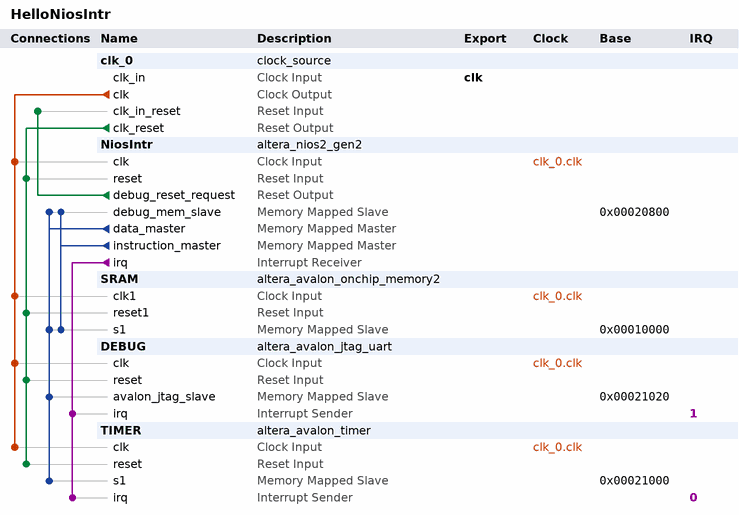
[diagram p0: system contents]
# Platform Designer (Qsys) system HelloNiosIntr, Cyclone V 5CSXFC6D6F31C6
# Parameters at their usual value, and those the tool derives, are not listed.
package require -exact qsys 21.1
create_system HelloNiosIntr
set_project_property DEVICE_FAMILY {Cyclone V}
set_project_property DEVICE 5CSXFC6D6F31C6

add_instance clk_0 clock_source 21.1
set_instance_parameter_value clk_0 clockFrequency 50000000

add_instance NiosIntr altera_nios2_gen2 21.1
set_instance_parameter_value NiosIntr dcache_size 2048
set_instance_parameter_value NiosIntr exceptionSlave SRAM.s1
set_instance_parameter_value NiosIntr icache_size 4096
set_instance_parameter_value NiosIntr impl Fast
set_instance_parameter_value NiosIntr resetSlave SRAM.s1

add_instance SRAM altera_avalon_onchip_memory2 21.1
set_instance_parameter_value SRAM dataWidth 32
set_instance_parameter_value SRAM dualPort false
set_instance_parameter_value SRAM initMemContent true
set_instance_parameter_value SRAM initializationFileName onchip_mem.hex
set_instance_parameter_value SRAM memorySize 40960

add_instance DEBUG altera_avalon_jtag_uart 21.1
set_instance_parameter_value DEBUG simInteractiveOptions NO_INTERACTIVE_WINDOWS

add_instance TIMER altera_avalon_timer 21.1
set_instance_parameter_value TIMER period 500
set_instance_parameter_value TIMER periodUnits MSEC

# connections
add_connection clk_0.clk DEBUG.clk clock
add_connection clk_0.clk NiosIntr.clk clock
add_connection clk_0.clk SRAM.clk1 clock
add_connection clk_0.clk TIMER.clk clock
add_connection clk_0.clk_reset DEBUG.reset reset
add_connection clk_0.clk_reset NiosIntr.reset reset
add_connection clk_0.clk_reset SRAM.reset1 reset
add_connection clk_0.clk_reset TIMER.reset reset
add_connection NiosIntr.debug_reset_request clk_0.clk_in_reset reset
add_connection NiosIntr.data_master DEBUG.avalon_jtag_slave avalon
set_connection_parameter_value NiosIntr.data_master/DEBUG.avalon_jtag_slave baseAddress 0x00021020
add_connection NiosIntr.data_master NiosIntr.debug_mem_slave avalon
set_connection_parameter_value NiosIntr.data_master/NiosIntr.debug_mem_slave baseAddress 0x00020800
add_connection NiosIntr.data_master SRAM.s1 avalon
set_connection_parameter_value NiosIntr.data_master/SRAM.s1 baseAddress 0x00010000
add_connection NiosIntr.data_master TIMER.s1 avalon
set_connection_parameter_value NiosIntr.data_master/TIMER.s1 baseAddress 0x00021000
add_connection NiosIntr.instruction_master NiosIntr.debug_mem_slave avalon
set_connection_parameter_value NiosIntr.instruction_master/NiosIntr.debug_mem_slave baseAddress 0x00020800
add_connection NiosIntr.instruction_master SRAM.s1 avalon
set_connection_parameter_value NiosIntr.instruction_master/SRAM.s1 baseAddress 0x00010000
add_connection NiosIntr.irq DEBUG.irq interrupt
set_connection_parameter_value NiosIntr.irq/DEBUG.irq irqNumber 1
add_connection NiosIntr.irq TIMER.irq interrupt
set_connection_parameter_value NiosIntr.irq/TIMER.irq irqNumber 0

# exported interfaces
add_interface clk clock sink
set_interface_property clk EXPORT_OF clk_0.clk_in

set_interconnect_requirement {$system} qsys_mm.clockCrossingAdapter HANDSHAKE
set_interconnect_requirement {$system} qsys_mm.enableEccProtection FALSE
set_interconnect_requirement {$system} qsys_mm.insertDefaultSlave FALSE
set_interconnect_requirement {$system} qsys_mm.maxAdditionalLatency 1

save_system HelloNiosIntr.qsys
